# EAGLE design ControllerBoard 2 (EAGLE 5.06)
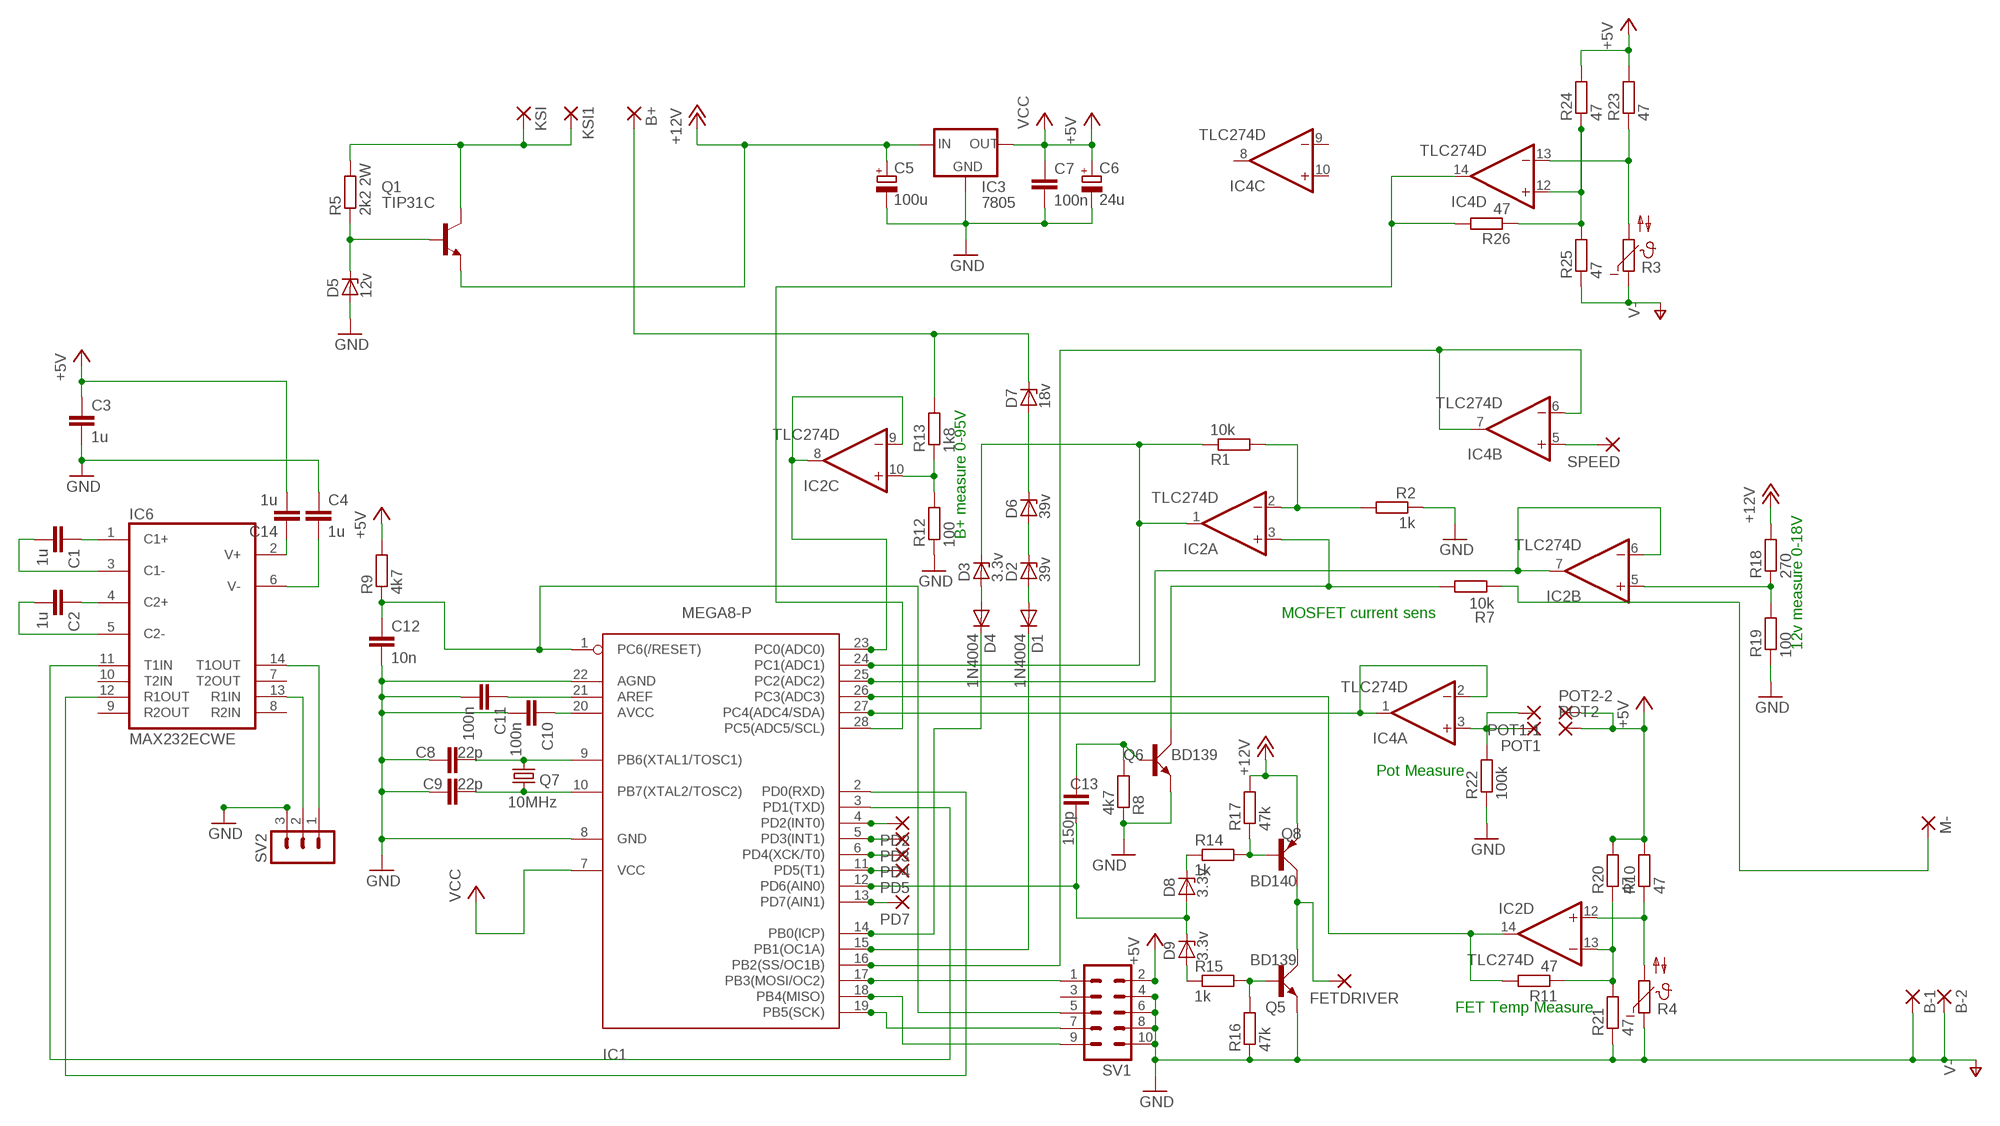
[diagram p0: schematic, sheet 1]

## Parts
B+  1,6/0,9  [1,6/0,9]
B-1  1,6/0,9  [1,6/0,9]
B-2  1,6/0,9  [1,6/0,9]
C1  1u  C-EU025-030X050  [C025-030X050]
C2  1u  C-EU025-030X050  [C025-030X050]
C3  1u  C-EU025-030X050  [C025-030X050]
C4  1u  C-EU025-030X050  [C025-030X050]
C5  100u  CPOL-EUE2.5-5  [E2,5-5]
C6  24u  CPOL-EUE2.5-5  [E2,5-5]
C7  100n  C-EU025_050-025X075  [C025_050-025X075]
C8  22p  C-EU050-024X044  [C050-024X044]
C9  22p  C-EU050-024X044  [C050-024X044]
C10  100n  C-EU025_050-025X075  [C025_050-025X075]
C11  100n  C-EU025_050-025X075  [C025_050-025X075]
C12  10n  C-EU025_050-025X075  [C025_050-025X075]
C13  150p  C-EU050-024X044  [C050-024X044]
C14  1u  C-EU025-030X050  [C025-030X050]
D1  1N4004  [DO41-10]
D2  39v  BZX55  [DO35Z10]
D3  3.3v  BZX55  [DO35Z10]
D4  1N4004  [DO41-10]
D5  12v  BZX55  [DO35Z10]
D6  39v  BZX55  [DO35Z10]
D7  18v  BZX55  [DO35Z10]
D8  3.3v  BZX55  [DO35Z10]
D9  3.3v  BZX55  [DO35Z10]
FETDRIVER  1,6/0,9  [1,6/0,9]
IC1  MEGA8-P  [DIL28-3]
IC2  TLC274D  [SO14]
IC3  7805  78XXL  [78XXL]
IC4  TLC274D  [SO14]
IC6  MAX232ECWE  [SO16L]
KSI  2,15/1,0  [2,15/1,0]
KSI1  2,15/1,0  [2,15/1,0]
M-  1,6/0,9  [1,6/0,9]
PD2  1,6/0,9  [1,6/0,9]
PD3  1,6/0,9  [1,6/0,9]
PD4  1,6/0,9  [1,6/0,9]
PD5  1,6/0,9  [1,6/0,9]
PD7  1,6/0,9  [1,6/0,9]
POT1  2,15/1,0  [2,15/1,0]
POT1-1  2,15/1,0  [2,15/1,0]
POT2  2,15/1,0  [2,15/1,0]
POT2-2  2,15/1,0  [2,15/1,0]
Q1  TIP31C  [TO220]
Q5  BD139  [TO126AV]
Q6  BD139  [TO126AV]
Q7  10MHz  CRYSTALHC49S  [HC49/S]
Q8  BD140  [TO126AV]
R1  10k  R-EU_0207/10  [0207/10]
R2  1k  R-EU_0207/10  [0207/10]
R3  NTC640-9  [N640]
R4  NTC640-9  [N640]
R5  2k2 2W  R-EU_0617/17  [0617/17]
R7  10k  R-EU_0207/10  [0207/10]
R8  4k7  R-EU_0207/10  [0207/10]
R9  4k7  R-EU_0207/10  [0207/10]
R10  47  R-EU_0207/10  [0207/10]
R11  47  R-EU_0207/10  [0207/10]
R12  100  R-EU_0207/10  [0207/10]
R13  1k8  R-EU_0207/10  [0207/10]
R14  1k  R-EU_0207/10  [0207/10]
R15  1k  R-EU_0207/10  [0207/10]
R16  47k  R-EU_0207/10  [0207/10]
R17  47k  R-EU_0207/10  [0207/10]
R18  270  R-EU_0207/10  [0207/10]
R19  100  R-EU_0207/10  [0207/10]
R20  47  R-EU_0207/10  [0207/10]
R21  47  R-EU_0207/10  [0207/10]
R22  100k  R-EU_0207/10  [0207/10]
R23  47  R-EU_0207/10  [0207/10]
R24  47  R-EU_0207/10  [0207/10]
R25  47  R-EU_0207/10  [0207/10]
R26  47  R-EU_0207/10  [0207/10]
SPEED  3,81/1,4  [3,81/1,4]
SV1  MA05-2  [MA05-2]
SV2  MA03-1  [MA03-1]

## Nets
+5V: SV1.2
+12V: C5.+ IC3.IN Q1.3(E) Q8.E R17.2 R18.2
GND: B-1.1(P) B-2.1(P) C3.2 C4.1 C5.- C6.- C7.2 C8.1 C9.1 C10.2 C11.2 C12.2 D5.A IC1.8(GND) IC1.22(AGND) IC3.GND Q5.E Q6.E R2.1 R4.1 R8.1 R12.1 R16.1 R19.1 R21.1 R22.1 SV1.4 SV1.6 SV1.8 SV1.10 SV2.3 ; supply symbol labelled V-
N$1: M-.1(P) R7.1
N$2: IC2.3(A:+IN) Q6.C R7.2
N$3: FETDRIVER.1(P) Q5.C Q8.C
N$4: C13.1 Q6.B R8.2
N$5: C10.1 IC1.20(AVCC)
N$6: C11.1 IC1.21(AREF)
N$7: IC2.2(A:-IN) R1.2 R2.2
N$8: D3.C IC1.24(PC1(ADC1)) IC2.1(A:OUT) R1.1
N$9: IC2.5(B:+IN) R18.1 R19.2
N$10: IC2.10(C:+IN) R12.2 R13.1
N$11: D5.C Q1.1(B) R5.1
N$12: C8.2 IC1.9(PB6(XTAL1/TOSC1)) Q7.1
N$13: C1.1 IC6.1(C1+)
N$14: C9.2 IC1.10(PB7(XTAL2/TOSC2)) Q7.2
N$15: C1.2 IC6.3(C1-)
N$16: IC6.13(R1IN) SV2.2
N$17: C2.1 IC6.4(C2+)
N$18: IC1.23(PC0(ADC0)) IC2.8(C:OUT) IC2.9(C:-IN)
N$19: IC6.14(T1OUT) SV2.1
N$20: IC1.17(PB3(MOSI/OC2)) SV1.1
N$21: IC1.19(PB5(SCK)) SV1.7
N$22: IC1.18(PB4(MISO)) SV1.9
N$23: IC2.13(D:-IN) R11.1 R20.1 R21.2
N$24: C13.2 D8.A D9.C IC1.12(PD6(AIN0))
N$25: C12.1 IC1.1(PC6(/RESET)) R9.1 SV1.5
N$26: IC1.26(PC3(ADC3)) IC2.14(D:OUT) R11.2
N$27: Q8.B R14.2 R17.1
N$28: D9.A R15.1
N$29: D8.C R14.1
N$30: Q5.B R15.2 R16.2
N$31: IC1.25(PC2(ADC2)) IC2.6(B:-IN) IC2.7(B:OUT)
N$32: IC1.11(PD5(T1)) PD5.1(P)
N$33: IC1.27(PC4(ADC4/SDA)) IC4.1(A:OUT) IC4.2(A:-IN)
N$34: IC4.3(A:+IN) POT1-1.1(P) POT1.1(P) R22.2
N$35: IC2.12(D:+IN) R4.2 R10.1
N$36: IC1.4(PD2(INT0)) PD2.1(P)
N$37: IC1.5(PD3(INT1)) PD3.1(P)
N$38: IC1.6(PD4(XCK/T0)) PD4.1(P)
N$39: D1.A D2.A
N$40: IC1.13(PD7(AIN1)) PD7.1(P)
N$41: D4.C IC1.14(PB0(ICP))
N$42: D1.C IC1.15(PB1(OC1A))
N$43: IC1.16(PB2(SS/OC1B)) IC4.6(B:-IN) IC4.7(B:OUT)
N$44: D3.A D4.A
N$45: D2.C D6.A
N$46: D6.C D7.A
N$47: IC4.13(D:-IN) R3.2 R23.1
N$48: IC4.5(B:+IN) SPEED.1(P)
N$49: IC4.12(D:+IN) R24.1 R25.2 R26.1
N$50: IC1.28(PC5(ADC5/SCL)) IC4.14(D:OUT) R26.2
N$51: C2.2 IC6.5(C2-)
N$52: IC1.3(PD1(TXD)) IC6.11(T1IN)
N$53: IC1.2(PD0(RXD)) IC6.12(R1OUT)
N$54: B+.1(P) D7.C R13.2
N$55: KSI1.1(P) KSI.1(P) Q1.2(C) R5.2
N$56: C4.2 IC6.6(V-)
N$57: C14.1 IC6.2(V+)
V-: R3.1 R25.1
VCC: C3.1 C6.+ C7.1 C14.2 IC1.7(VCC) IC3.OUT POT2-2.1(P) POT2.1(P) R9.2 R10.2 R20.2 R23.2 R24.2 ; supply symbol labelled +5V
Unconnected: IC4.8(C:OUT) IC4.9(C:-IN) IC4.10(C:+IN) IC6.7(T2OUT) IC6.8(R2IN) IC6.9(R2OUT) IC6.10(T2IN) SV1.3

## Notes on the sheet
- B+ measure 0-95V
- MOSFET current sens
- 12v measure 0-18V
- Pot Measure
- FET Temp Measure

## Power pins joined to a net without a drawn wire
GND: IC2.11(P:V-) IC4.11(P:V-) IC6.15(GND)
V+: IC2.4(P:V+) IC4.4(P:V+)
VCC: IC6.16(VCC)

## Library data of the parts
B+ B-1 B-2 FETDRIVER M- PD2-PD5 PD7 = wirepad:1,6/0,9: THROUGH-HOLE PAD
C1-C4 C7-C14 = rcl:C-EU: CAPACITOR, European symbol
C5 C6 = rcl:CPOL-EU: POLARIZED CAPACITOR, European symbol
D1 D4 = diode:1N4004: DIODE general purpose rectifier, 1 A
D2 D3 D5-D9 = diode:BZX55: Z DIODE
IC1 = atmel:MEGA8-P: MICROCONTROLLER 8 Kbytes FLASH 1 kbytes SRAM 512 bytes EEPROM USART 4-channel 10 bit ADC 2-channel 8 bit ADC Source: avr.lbr
IC2 IC4 = linear:TLC274: OP AMP
IC3 = v-reg:78XXL: VOLTAGE REGULATOR
IC6 = maxim:MAX232ECWE: RS232 TRANSEIVER
KSI KSI1 POT1 POT1-1 POT2 POT2-2 = wirepad:2,15/1,0: THROUGH-HOLE PAD
Q1 = transistor-npn:TIP31C*: NPN Transistor
Q5 Q6 = transistor-power:BD139: NPN TRANSISTOR
Q7 = crystal:CRYSTAL: CRYSTAL
Q8 = transistor-power:BD140: PNP TRANSISTOR
R1 R2 R5 R7-R26 = rcl:R-EU_: RESISTOR, European symbol
R3 R4 = ptc-ntc:NTC640-9: PHILIPS NTC
SPEED = wirepad:3,81/1,4: THROUGH-HOLE PAD
SV1 = con-lstb:MA05-2: PIN HEADER
SV2 = con-lstb:MA03-1: PIN HEADER

## Board
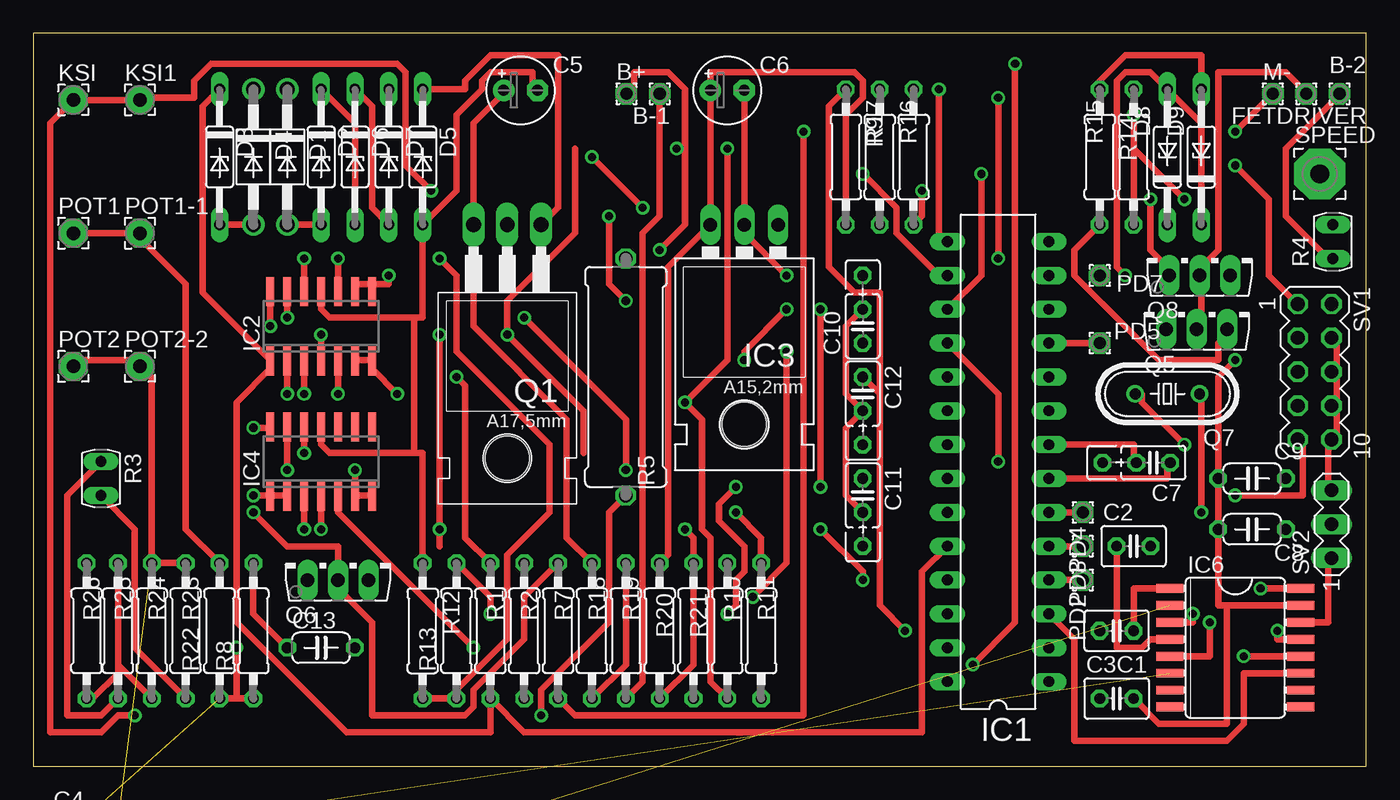
[diagram p1: board, top side]
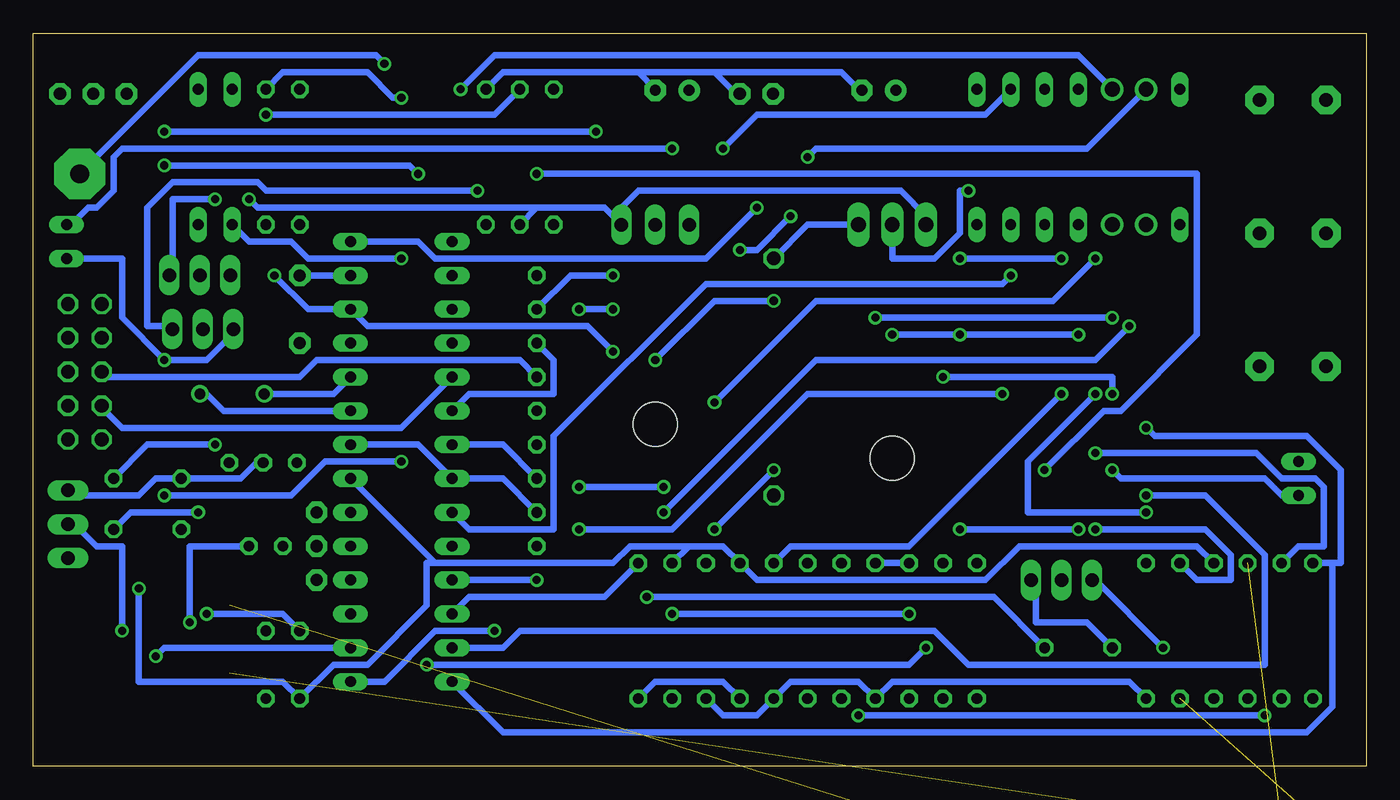
[diagram p2: board, bottom side, seen from below]

Size 100 x 55 mm. Coordinates in mm from the lower left corner, seen from the top.
Outline: 0,0 100,0 100,55 0,55 0,0
Copper layers (1*16): Top 0.035mm / dielectric 1.5mm / Bottom 0.035mm
Design rules "10mil *": minimum track width 0.5mm, minimum drill 24mil, track to track 10mil, track to pad 10mil, pad to pad 10mil, via to via 10mil, smd to smd 10mil, copper to edge 40mil, drill to drill 10mil, minimum pad ring 10mil, minimum via ring 8mil, stop-mask expansion 0mil, vias tented up to drill 0mil, thermal gap 10mil

### Footprints (pad centres in the part's own frame; a part is rotated, then mirrored left to right if it is on the bottom)
1,6/0,9 = drill 0.914 pad 1.6 octagon: 1 0,0
C025-030X050 = drill 0.813 octagon: 1 -1.27,0; 2 1.27,0
E2,5-5 = drill 0.813 pad 1.6 round: + -1.27,0 | drill 0.813 pad 1.6 octagon: - 1.27,0
C025_050-025X075 = drill 0.813 octagon: 1 -1.27,0; 2 1.27,0; 3 3.81,0
C050-024X044 = drill 0.813 octagon: 1 -2.54,0; 2 2.54,0
DO41-10 = drill 1.118 round: A 5.08,0; C -5.08,0
DO35Z10 = drill 0.813 long: A 5.08,0; C -5.08,0
DIL28-3 = drill 0.813 long: 1 -16.51,-3.81; 2 -13.97,-3.81; 3 -11.43,-3.81; 4 -8.89,-3.81; 5 -6.35,-3.81; 6 -3.81,-3.81; 7 -1.27,-3.81; 8 1.27,-3.81; 9 3.81,-3.81; 10 6.35,-3.81; 11 8.89,-3.81; 12 11.43,-3.81; 13 13.97,-3.81; 14 16.51,-3.81; 15 16.51,3.81; 16 13.97,3.81; 17 11.43,3.81; 18 8.89,3.81; 19 6.35,3.81; 20 3.81,3.81; 21 1.27,3.81; 22 -1.27,3.81; 23 -3.81,3.81; 24 -6.35,3.81; 25 -8.89,3.81; 26 -11.43,3.81; 27 -13.97,3.81; 28 -16.51,3.81
SO14 = smd 0.6 x 2.2: 1 -3.81,-2.6; 2 -2.54,-2.6; 3 -1.27,-2.6; 4 0,-2.6; 5 1.27,-2.6; 6 2.54,-2.6; 7 3.81,-2.6; 8 3.81,2.6; 9 2.54,2.6; 10 1.27,2.6; 11 0,2.6; 12 -1.27,2.6; 13 -2.54,2.6; 14 -3.81,2.6
78XXL = drill 1.016 long: GND 0,-3.81; IN -2.54,-3.81; OUT 2.54,-3.81 | hole 3.302: 0,11.176
SO16L = smd 0.66 x 2.032: 1 -4.445,-4.902; 2 -3.175,-4.902; 3 -1.905,-4.902; 4 -0.635,-4.902; 5 0.635,-4.902; 6 1.905,-4.902; 7 3.175,-4.902; 8 4.445,-4.902; 9 4.445,4.902; 10 3.175,4.902; 11 1.905,4.902; 12 0.635,4.902; 13 -0.635,4.902; 14 -1.905,4.902; 15 -3.175,4.902; 16 -4.445,4.902
2,15/1,0 = drill 1.016 pad 2.159 octagon: 1 0,0
TO220 = drill 1.118 long: 1 -2.54,-6.35; 2 0,-6.35; 3 2.54,-6.35 | hole 3.302: 0,11.176
TO126AV = drill 1.016 long: B 2.286,-1.27; C 0,-1.27; E -2.286,-1.27
HC49/S = drill 0.813 round: 1 -2.413,0; 2 2.413,0
0207/10 = drill 0.813 octagon: 1 -5.08,0; 2 5.08,0
N640 = drill 0.813 long: 1 -1.27,0; 2 1.27,0
0617/17 = drill 1.016 octagon: 1 -8.89,0; 2 8.89,0
3,81/1,4 = drill 1.397 pad 3.81 octagon: 1 0,0
MA05-2 = drill 1.016 octagon: 1 -5.08,-1.27; 2 -5.08,1.27; 3 -2.54,-1.27; 4 -2.54,1.27; 5 0,-1.27; 6 0,1.27; 7 2.54,-1.27; 8 2.54,1.27; 9 5.08,-1.27; 10 5.08,1.27
MA03-1 = drill 1.016 long: 1 -2.54,0; 2 0,0; 3 2.54,0

### Placement (x,y rotation side)
B+  44.5,50.46 0 top
B-1  47,50.46 180 top
B-2  98,50.46 180 top
C1  81.28,10.16 180 top
C2  82.55,16.51 0 top
C3  81.28,5.08 0 top
C4  3.81,-5.08 0 top  (outside the outline)
C5  36.56,50.72 0 top
C6  52.07,50.72 0 top
C7  84.03,22.78 180 top
C8  91.44,17.78 0 top
C9  91.44,21.59 0 top
C10  62.23,33.02 90 top
C11  62.23,20.32 270 top
C12  62.23,27.94 270 top
C13  21.59,8.89 0 top
C14  3.81,-13.97 0 top  (outside the outline)
D1  19.05,45.72 270 top
D2  21.59,45.72 270 top
D3  13.97,45.72 270 top
D4  16.51,45.72 270 top
D5  29.21,45.72 270 top
D6  24.13,45.72 270 top
D7  26.67,45.72 270 top
D8  85.09,45.72 90 top
D9  87.63,45.72 90 top
FETDRIVER  95.5,50.46 180 top
IC1  72.39,22.86 90 top
IC2  21.59,33.02 0 top
IC3  53.34,36.83 180 top
IC4  21.59,22.86 0 top
IC6  90.17,8.89 270 top
KSI  3,50 0 top
KSI1  8,50 0 top
M-  93,50.46 0 top
PD2  78.74,13.97 0 top
PD3  78.74,16.51 0 top
PD4  78.74,19.05 90 top
PD5  80.01,31.75 180 top
PD7  80.01,36.83 0 top
POT1  3,40 0 top
POT1-1  8,40 0 top
POT2  3,30 0 top
POT2-2  8,30 0 top
Q1  35.56,34.29 180 top
Q5  87.29,34.07 0 top
Q6  22.86,15.24 0 top
Q7  85.09,27.94 180 top
Q8  87.51,38.12 0 top
R1  34.29,10.16 90 top
R2  36.83,10.16 90 top
R3  5.08,21.59 270 top
R4  97.5,39.37 90 top
R5  44.45,29.21 270 top
R7  39.37,10.16 90 top
R8  16.51,10.16 90 top
R9  60.96,45.72 270 top
R10  52.07,10.16 90 top
R11  54.61,10.16 90 top
R12  29.21,10.16 270 top
R13  31.75,10.16 90 top
R14  82.55,45.72 270 top
R15  80.01,45.72 270 top
R16  66.04,45.72 270 top
R17  63.5,45.72 270 top
R18  41.91,10.16 90 top
R19  44.45,10.16 90 top
R20  46.99,10.16 90 top
R21  49.53,10.16 90 top
R22  13.97,10.16 90 top
R23  11.43,10.16 90 top
R24  8.89,10.16 90 top
R25  6.35,10.16 90 top
R26  4,10.16 90 top
SPEED  96.52,44.45 0 top
SV1  96.14,29.6 270 top
SV2  97.4,18.16 90 top

### Tracks (layer width: path | path; a pad name or v marks a point on that pad's centre or on a via)
+12V  (via drill 0.61)
  Top 0.5: v83.82,42.55 83.82,38.73 85.09,37.47 Q8.E | R18.2 40.01,17.14 40.01,26.04 33.02,33.02 Q1.3 33.02,48.26 34.92,50.16 C5.+
  Bottom 0.5: 62.23,41.91 R17.2 | 62.23,41.91 57.15,41.91 56.52,41.27 | v83.82,42.55 83.19,41.91 62.23,41.91 | 56.52,41.27 54.61,43.18 34.92,43.18 33.02,41.27 Q1.3 | 56.52,41.27 IC3.IN
GND  (via drill 0.61)  (1 unrouted)
  Top 0.5: R4.1 97.16,38.1 93.98,41.27 93.98,46.35 97.79,50.16 B-2.1 | C10.2 60.96,33.02 60.96,27.94 C12.2 60.96,25.4 60.96,20.32 C11.2 | SV2.3 97.16,20.95 97.16,24.13 SV1.10 97.79,24.77 97.79,26.67 SV1.8 97.79,27.3 97.79,29.21 SV1.6 97.79,29.84 97.79,31.75 SV1.4 | 89.53,12.06 88.9,12.06 C8.1 C9.1 88.9,29.21 v90.17,30.48 | 89.53,12.06 IC6.15 | C3.2 84.45,3.17 89.53,3.17 89.53,12.06 | IC1.8 82.55,24.13 82.55,22.86 C7.2 | 15.24,5.08 R8.1 | R22.1 15.24,5.08 | 15.24,5.08 v15.24,8.89 | 28.57,33.66 29.21,33.66 D5.A 31.75,43.18 31.75,48.9 33.66,50.8 33.66,51.44 34.29,52.07 37.47,52.07 37.47,50.8 C5.- | 28.57,33.66 22.23,33.66 21.59,34.29 IC2.11 | 28.57,23.5 29.21,23.5 R12.1 | 28.57,23.5 22.23,23.5 21.59,24.13 IC4.11 | 28.57,33.66 28.57,23.5 | C6.- IC3.GND 53.34,40.01 v56.52,36.83 | R19.1 45.72,6.35 45.72,40.01 46.99,41.27 46.99,50.16 B-1.1
  Bottom 0.5: Q5.E 85.09,32.38 87,30.48 v90.17,30.48 93.34,33.66 93.34,38.1 R4.1 | C11.2 64.77,21.59 IC1.22 71.12,24.13 IC1.8 | C7.2 83.19,22.86 84.45,21.59 C9.1 90.81,21.59 92.08,20.32 97.16,20.32 SV2.3 | R21.1 48.26,3.81 45.72,3.81 R19.1 43.18,6.35 38.1,6.35 R2.1 35.56,6.35 17.78,6.35 R8.1 | v15.24,8.89 20.32,13.97 Q6.E | R16.1 64.77,52.07 54.61,52.07 | 54.61,52.07 53.34,50.8 C6.- | 48.9,52.07 47.62,50.8 B-1.1 | 48.9,52.07 54.61,52.07 | 48.9,52.07 39.37,52.07 38.1,50.8 C5.- | C10.2 59.69,36.83 v56.52,36.83
N$1  (via drill 0.61)
  Top 0.5: R7.1 40.64,3.81 57.78,3.81 v57.78,47.62 | v90.17,47.62 92.71,50.16 M-.1
  Bottom 0.5: v57.78,47.62 v90.17,47.62
N$2  (via drill 0.61)
  Top 0.5: v16.51,19.05 19.05,16.51 22.86,16.51 Q6.C 22.86,13.34 25.4,10.79 25.4,3.81 32.38,3.81 33.02,4.45 33.02,5.71 36.83,9.53 36.83,12.7 R7.2 | v20.32,27.94 IC2.3
  Bottom 0.5: v20.32,27.94 25.4,22.86 25.4,19.05 v16.51,19.05
N$3
  Top 0.5: Q5.C 87.63,33.02 87.63,36.83 Q8.C 87.63,37.47 88.9,38.73 88.9,52.07 93.98,52.07 95.25,50.8 FETDRIVER.1
N$4
  Top 0.5: C13.1 16.51,11.43 R8.2
  Bottom 0.5: C13.1 20.95,10.79 24.77,10.79 24.77,13.97 Q6.B
N$5
  Bottom 0.5: C10.1 60.96,30.48 60.96,27.94 67.31,27.94 IC1.20
N$6
  Bottom 0.5: C11.1 64.77,24.13 IC1.21
N$7  (via drill 0.61)
  Top 0.5: v31.75,29.21 32.38,28.57 32.38,17.14 R1.2 | IC2.2 v19.05,27.94
  Bottom 0.5: v19.05,27.94 19.05,29.21 v31.75,29.21 | R1.2 R2.2
N$8
  Top 0.5: D3.C 12.7,49.53 12.7,35.56 17.78,30.48 IC2.1 17.78,29.84 15.24,27.3 15.24,10.79 23.5,2.54 34.29,2.54 R1.1 36.83,2.54 66.67,2.54 66.67,14.61 IC1.24
N$9  (via drill 0.61)
  Top 0.5: v22.86,27.94 IC2.5 | R18.1 44.45,7.62 R19.2
  Bottom 0.5: v22.86,27.94 34.29,16.51 43.18,16.51 R19.2
N$10  (via drill 0.61)
  Top 0.5: v30.48,38.1 31.75,36.83 31.75,31.11 38.73,24.13 38.73,19.05 35.56,15.88 35.56,9.53 31.75,5.71 R13.1 R12.2 | v22.86,38.1 IC2.10
  Bottom 0.5: v30.48,38.1 v22.86,38.1
N$11
  Top 0.5: D5.C 32.38,50.8 32.38,51.44 34.29,53.34 39.37,53.34 39.37,41.91 Q1.1
  Bottom 0.5: R5.1 41.91,40.64 Q1.1
N$12  (via drill 0.61)
  Top 0.5: v87.63,19.05 87.63,27.94 Q7.1
  Bottom 0.5: IC1.9 85.72,26.67 87,27.94 Q7.1 | C8.2 92.71,19.05 v87.63,19.05
N$13
  Top 0.5: C1.1 82.55,13.34 IC6.1
N$14  (via drill 0.61)
  Top 0.5: v86.36,24.13 83.19,27.3 83.19,27.94 Q7.2
  Bottom 0.5: IC1.10 77.47,27.94 Q7.2 | C9.2 91.44,24.13 v86.36,24.13
N$15  (via drill 0.61)
  Top 0.5: v87,11.43 87,10.79 IC6.3
  Bottom 0.5: v87,11.43 81.28,11.43 C1.2
N$16  (via drill 0.61)
  Top 0.5: v93.34,10.16 93.34,9.53 IC6.13
  Bottom 0.5: v93.34,10.16 93.34,16.51 95.25,16.51 96.52,17.78 97.16,17.78 SV2.2
N$17
  Top 0.5: C2.1 81.28,8.89 83.19,8.89 83.82,9.53 IC6.4
N$18  (via drill 0.61)
  Top 0.5: 25.4,36.2 24.13,36.2 IC2.9 | 25.4,36.2 26.67,36.2 v26.67,36.83 | 25.4,36.2 IC2.8
  Bottom 0.5: v26.67,36.83 27.3,36.2 49.53,36.2 60.96,24.77 60.96,17.78 67.31,17.78 IC1.23
N$19
  Top 0.5: IC6.14 97.16,10.79 97.16,15.24 SV2.1
N$20  (via drill 0.61)
  Top 0.5: IC1.17 71.12,36.83 v71.12,44.45 | v90.17,45.09 92.71,42.55 92.71,36.83 94.61,34.92 SV1.1
  Bottom 0.5: v71.12,44.45 71.75,45.09 v90.17,45.09
N$21
  Bottom 0.5: IC1.19 72.39,25.4 93.34,25.4 94.61,26.67 SV1.7
N$22  (via drill 0.61)
  Top 0.5: IC1.18 72.39,27.94 v72.39,22.86 | v90.17,20.32 95.25,20.32 95.25,24.13 SV1.9
  Bottom 0.5: v72.39,22.86 78.11,22.86 80.64,20.32 v90.17,20.32
N$23  (via drill 0.61)
  Top 0.5: v36.83,33.66 44.45,26.04 v44.45,22.23 | v48.9,17.78 49.53,17.14 R21.2 49.53,7.62 R20.1 | v19.05,33.66 IC2.13
  Bottom 0.5: v36.83,33.66 v19.05,33.66 | v48.9,17.78 v44.45,22.23 | R11.1 53.34,6.35 48.26,6.35 R20.1
N$24  (via drill 0.61)
  Top 0.5: D9.C 87.63,48.26 D8.A 83.82,52.07 81.92,52.07 81.28,51.44 81.28,37.47 v81.92,36.83 | v53.98,12.7 56.52,15.24 v56.52,31.11
  Bottom 0.5: C13.2 27.94,12.7 v53.98,12.7 | v56.52,31.11 58.42,33.02 74.93,33.02 IC1.12 79.38,34.29 v81.92,36.83
N$25  (via drill 0.61)
  Top 0.5: v65.41,10.16 63.5,12.06 63.5,27.94 | 63.5,27.94 C12.1 | R9.1 59.69,49.53 59.69,37.47 61.59,35.56 63.5,35.56 63.5,27.94
  Bottom 0.5: IC1.1 73.66,6.35 69.85,10.16 v65.41,10.16 | C12.1 63.5,30.48 78.74,30.48 80.01,29.21 94.61,29.21 SV1.5
N$26  (via drill 0.61)
  Top 0.5: v52.7,19.05 54.61,17.14 R11.2 | v17.78,33.02 IC2.14
  Bottom 0.5: v17.78,33.02 20.32,30.48 41.27,30.48 v52.7,19.05 | IC1.26 67.31,12.7 57.15,12.7 R11.2
N$27  (via drill 0.61)
  Top 0.5: 82.55,46.35 R14.2 | v82.55,48.9 82.55,46.35 | 82.55,46.35 v86.36,42.55
  Bottom 0.5: R17.1 65.41,48.9 v82.55,48.9 | v86.36,42.55 89.53,42.55 89.53,37.47 Q8.B
N$28
  Top 0.5: R15.1 80.01,51.44 81.92,53.34 87.63,53.34 D9.A
N$29  (via drill 0.61)
  Top 0.5: v72.39,38.1 v72.39,50.16
  Bottom 0.5: R14.1 81.28,52.07 74.93,52.07 73.03,50.16 v72.39,50.16 | v72.39,38.1 79.38,38.1 80.64,39.37 83.82,39.37 D8.C
N$30  (via drill 0.61)
  Top 0.5: R16.2 66.67,41.27 v66.67,43.18 | R15.2 78.11,38.73 78.11,36.83 84.45,30.48 88.9,30.48 88.9,31.75 89.53,32.38 Q5.B
  Bottom 0.5: v66.67,43.18 82.55,43.18 83.19,43.81 89.53,43.81 91.44,41.91 91.44,33.02 90.17,33.02 Q5.B
N$31  (via drill 0.61)
  Top 0.5: IC2.6 24.13,30.48 25.4,30.48 IC2.7 25.4,29.84 v27.3,27.94 | v59.05,17.78 62.23,14.61 v62.23,13.97
  Bottom 0.5: v27.3,27.94 41.91,27.94 52.07,17.78 v59.05,17.78 | v62.23,13.97 IC1.25
N$32
  Top 0.5: IC1.11 PD5.1
N$33  (via drill 0.61)
  Top 0.5: 17.78,20.32 19.05,20.32 IC4.2 | v16.51,20.32 17.78,20.32 | 17.78,20.32 IC4.1
  Bottom 0.5: v16.51,20.32 12.06,20.32 7.62,15.88 7.62,7.62 29.84,7.62 32.38,10.16 63.5,10.16 64.77,8.89 IC1.27
N$34  (via drill 0.61)
  Top 0.5: POT1.1 3.17,40.01 7.62,40.01 POT1-1.1 8.26,39.37 11.43,36.2 11.43,17.78 R22.2 | v20.32,17.78 IC4.3
  Bottom 0.5: v20.32,17.78 12.06,17.78 10.16,15.88 10.16,13.97 12.7,13.97 R22.2
N$35  (via drill 0.61)
  Top 0.5: R10.1 50.8,6.35 50.8,17.14 50.16,17.78 50.16,26.04 v48.9,27.3 52.07,30.48 v52.07,46.35 | IC2.12 v20.32,38.1
  Bottom 0.5: v20.32,38.1 23.5,34.92 41.27,34.92 v48.9,27.3 | v52.07,46.35 93.34,46.35 93.98,45.72 93.98,43.18 95.25,41.91 95.89,41.91 97.16,40.64 R4.2
N$36
  Top 0.5: IC1.4 PD2.1
N$37
  Top 0.5: IC1.5 PD3.1
N$38
  Top 0.5: IC1.6 PD4.1
N$39
  Top 0.5: D1.A D2.A
N$40
  Bottom 0.5: IC1.13 PD7.1
N$41  (via drill 0.61)
  Top 0.5: v41.91,45.72 v45.72,41.91
  Bottom 0.5: IC1.14 71.12,39.37 69.85,38.1 49.53,38.1 v45.72,41.91 | v41.91,45.72 41.27,46.35 20.95,46.35 D4.C
N$42  (via drill 0.61)
  Top 0.5: IC1.15 67.94,40.01 v67.94,50.8
  Bottom 0.5: v67.94,50.8 65.41,53.34 21.59,53.34 D1.C
N$43  (via drill 0.61)
  Top 0.5: 24.13,20.32 25.4,20.32 IC4.7 | 24.13,20.32 v24.13,22.23 | v62.23,44.45 64.77,41.91 64.77,40.01 67.94,36.83 IC1.16 | IC4.6 24.13,20.32
  Bottom 0.5: v24.13,22.23 19.68,26.67 18.41,26.67 12.7,32.38 12.7,44.45 v62.23,44.45
N$44
  Top 0.5: D3.A D4.A
N$45
  Top 0.5: D6.A 24.13,48.26 D2.C
N$46
  Top 0.5: D7.A 25.4,41.91 25.4,49.53 D6.C
N$47  (via drill 0.61)
  Top 0.5: v19.05,22.23 IC4.13 | R23.1 7.62,8.89 7.62,17.78 R3.2
  Bottom 0.5: v19.05,22.23 18.41,21.59 7.62,21.59 6.35,20.32 R3.2
N$48  (via drill 0.61)
  Top 0.5: v33.02,8.89 22.86,19.05 IC4.5 | v70.48,7.62 73.66,10.79 v73.66,52.7
  Bottom 0.5: v33.02,8.89 34.29,7.62 v70.48,7.62 | v73.66,52.7 74.3,53.34 87.63,53.34 SPEED.1
N$49  (via drill 0.61)
  Top 0.5: v20.32,23.5 IC4.12 | 6.35,7.62 R25.2 | 6.35,7.62 6.35,6.99 4.45,5.08 R26.1 | 6.35,7.62 R24.1
  Bottom 0.5: v20.32,23.5 8.26,23.5 6.35,21.59 3.81,21.59 3.17,20.95 3.17,16.51 5.08,16.51 R25.2
N$50  (via drill 0.61)
  Top 0.5: v16.51,25.4 17.78,25.4 IC4.14
  Bottom 0.5: v16.51,25.4 15.88,24.77 4.45,24.77 1.91,22.23 1.91,15.24 2.54,15.24 | 2.54,15.24 R26.2 | IC1.28 64.77,2.54 4.45,2.54 2.54,4.45 2.54,15.24
N$51  (via drill 0.61)
  Top 0.5: v88.27,10.79 88.27,8.26 IC6.5
  Bottom 0.5: v88.27,10.79 88.27,16.51 C2.2
N$52
  Top 0.5: IC1.3 78.11,9.53 78.11,1.91 89.53,1.91 90.81,3.17 90.81,6.99 IC6.11
N$53  (via drill 0.61)
  Top 0.5: v90.81,8.26 IC6.12
  Bottom 0.5: v90.81,8.26 90.17,8.89 IC1.2
N$54  (via drill 0.61)
  Top 0.5: R13.2 34.29,12.7 v34.29,11.43 | v52.07,11.43 52.7,12.06 52.7,13.97 53.34,14.61 53.34,16.51 51.44,18.41 51.44,19.68 v52.7,20.95 | v59.05,20.95 v59.05,34.29 | v56.52,34.29 53.34,31.11 v53.34,30.48 | v44.45,34.92 43.18,36.2 v43.18,41.27 | v46.99,38.73 48.9,40.64 48.9,46.35 | 48.9,46.35 48.9,50.8 47.62,52.07 45.09,52.07 45.09,50.8 B+.1 | 48.9,46.35 v48.26,46.35
  Bottom 0.5: D7.C 28.57,48.9 45.72,48.9 v48.26,46.35 | v34.29,11.43 v52.07,11.43 | v52.7,20.95 v59.05,20.95 | v59.05,34.29 v56.52,34.29 | v53.34,30.48 48.9,34.92 v44.45,34.92 | v43.18,41.27 45.72,38.73 v46.99,38.73
N$55  (via drill 0.61)
  Top 0.5: v29.84,43.18 27.94,45.09 27.94,52.07 27.3,52.7 13.34,52.7 12.06,51.44 12.06,50.16 8.26,50.16 KSI1.1 KSI.1 2.54,49.53 1.27,48.26 1.27,2.54 5.08,2.54 6.35,3.81 v7.62,3.81 | R5.2 43.18,19.05 43.18,10.79 38.1,5.71 v38.1,3.81
  Bottom 0.5: Q1.2 35.56,38.1 32.38,38.1 30.48,40.01 30.48,43.18 v29.84,43.18 | v7.62,3.81 v38.1,3.81
N$56  (1 unrouted)
N$57  (1 unrouted)
V+  (via drill 0.61)
  Top 0.5: IC4.4 v21.59,17.78 | v21.59,32.38 IC2.4 | 41.27,23.5 41.27,26.67 v35.56,32.38 35.56,34.92 40.64,40.01 40.64,46.35 | 30.48,16.51 v30.48,17.78 v30.48,32.38
  Bottom 0.5: v35.56,32.38 v30.48,32.38 v21.59,32.38 | v21.59,17.78 v30.48,17.78
V-
  Top 0.5: R25.1 5.08,3.81 2.54,3.81 2.54,20.32 R3.1
VCC  (via drill 0.61)  (1 unrouted)
  Top 0.5: R23.2 R24.2 8.89,29.21 8.26,29.84 POT2-2.1 7.62,30.48 3.17,30.48 POT2.1 | v92.08,13.34 IC6.16 | IC1.7 85.09,21.59 85.09,22.23 C7.1 | R9.2 60.96,48.9 62.23,50.16 62.23,51.44 61.59,52.07 50.8,52.07 C6.+ IC3.OUT 47.62,37.47 47.62,15.88 R20.2
  Bottom 0.5: v92.08,13.34 92.08,6.35 81.28,6.35 C3.1 77.47,7.62 74.93,7.62 70.48,12.06 70.48,15.24 69.85,15.24 | 50.8,16.51 48.26,16.51 R20.2 45.72,13.97 28.57,13.97 26.04,16.51 12.7,16.51 R23.2 | 50.8,16.51 R10.2 | 69.85,15.24 IC1.7 | 69.85,15.24 56.52,15.24 55.24,16.51 50.8,16.51